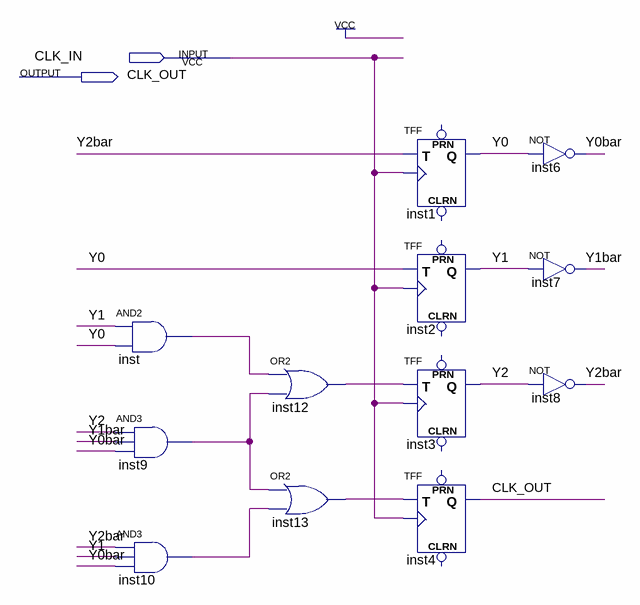
[diagram p0: schematic sheet]
// Quartus schematic Block2.bdf as structural Verilog: 12 symbols, 2 pins
module Block2 (
  input  CLK_IN,
  output CLK_OUT
);

  wire inst9_out, inst10_out, inst12_out, inst13_out, inst_out, Y0, Y0bar, Y1, Y1bar, Y2, Y2bar;

  and inst (inst_out, Y1, Y0);
  and inst9 (inst9_out, Y2, Y1bar, Y0bar);
  and inst10 (inst10_out, Y2bar, Y1, Y0bar);
  or inst12 (inst12_out, inst_out, inst9_out);
  or inst13 (inst13_out, inst9_out, inst10_out);
  TFF inst1 (.T(Y2bar), .CLK(CLK_IN), .Q(Y0));  // open: PRN, CLRN
  TFF inst2 (.T(Y0), .CLK(CLK_IN), .Q(Y1));  // open: PRN, CLRN
  TFF inst3 (.T(inst12_out), .CLK(CLK_IN), .Q(Y2));  // open: PRN, CLRN
  TFF inst4 (.T(inst13_out), .CLK(CLK_IN), .Q(CLK_OUT));  // open: PRN, CLRN
  not inst6 (Y0bar, Y0);
  not inst7 (Y1bar, Y1);
  not inst8 (Y2bar, Y2);
endmodule
